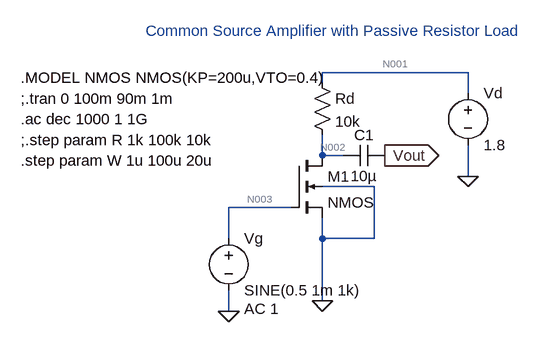
[diagram p0: schematic CS_amplifier.asc]
CS_amplifier.asc, the LTspice schematic file:
Version 4
SHEET 1 880 680
WIRE 400 0 176 0
WIRE 176 16 176 0
WIRE 400 32 400 0
WIRE 176 128 176 96
WIRE 208 128 176 128
WIRE 400 160 400 112
WIRE 256 176 176 176
WIRE 128 208 32 208
WIRE 32 256 32 208
WIRE 176 256 176 224
WIRE 256 256 256 176
WIRE 256 256 176 256
WIRE 176 352 176 256
WIRE 32 368 32 336
FLAG 176 352 0
FLAG 400 160 0
FLAG 32 368 0
FLAG 272 128 Vout
IOPIN 272 128 Out
SYMBOL nmos4 128 128 R0
SYMATTR InstName M1
SYMATTR Value2 l=0.18u w={W}
SYMBOL voltage 400 16 R0
WINDOW 123 0 0 Left 0
WINDOW 39 0 0 Left 0
SYMATTR InstName Vd
SYMATTR Value 1.8
SYMBOL voltage 32 240 R0
WINDOW 123 24 124 Left 2
WINDOW 39 0 0 Left 0
SYMATTR Value2 AC 1
SYMATTR InstName Vg
SYMATTR Value SINE(0.5 1m 1k)
SYMBOL res 160 0 R0
SYMATTR InstName Rd
SYMATTR Value 10k
SYMBOL cap 272 112 R90
WINDOW 0 0 32 VBottom 2
WINDOW 3 32 32 VTop 2
SYMATTR InstName C1
SYMATTR Value 10µ
TEXT -288 40 Left 2 !;.tran 0 100m 90m 1m
TEXT -288 8 Left 2 !.MODEL NMOS NMOS(KP=200u,VTO=0.4)
TEXT -288 72 Left 2 !.ac dec 1000 1 1G
TEXT -288 104 Left 2 !;.step param R 1k 100k 10k
TEXT -288 136 Left 2 !.step param W 1u 100u 20u
TEXT -96 -64 Left 2 ;Common Source Amplifier with Passive Resistor Load

The netlist it stands for:
* CS_amplifier.asc
M1 N002 N003 0 0 NMOS l=0.18u w={W}
Vd N001 0 1.8
Vg N003 0 SINE(0.5 1m 1k) AC 1
Rd N001 N002 10k
C1 Vout N002 10µ
.model NMOS NMOS
.model PMOS PMOS
.lib standard.mos
;.tran 0 100m 90m 1m
.MODEL NMOS NMOS(KP=200u,VTO=0.4)
.ac dec 1000 1 1G
;.step param R 1k 100k 10k
.step param W 1u 100u 20u
* Common Source Amplifier with Passive Resistor Load
.backanno
.end

* Results of the author's LTspice run, read from the files saved beside the schematic
* Operating Point (first step), zero values left out:
*   w = 1 µ
*   V(n002) = 1.744 V
*   V(n003) = 500 mV
*   V(n001) = 1.8 V
*   V(vout) = 17.44 µV
*   Id(M1) = 5.556 µA
*   Ib(M1) = -1.754 pA
*   Is(M1) = -5.556 µA
*   I(Rd) = 5.556 µA
*   I(Vd) = -5.556 µA